# Altium schematic sheet power.SchDoc
size A4
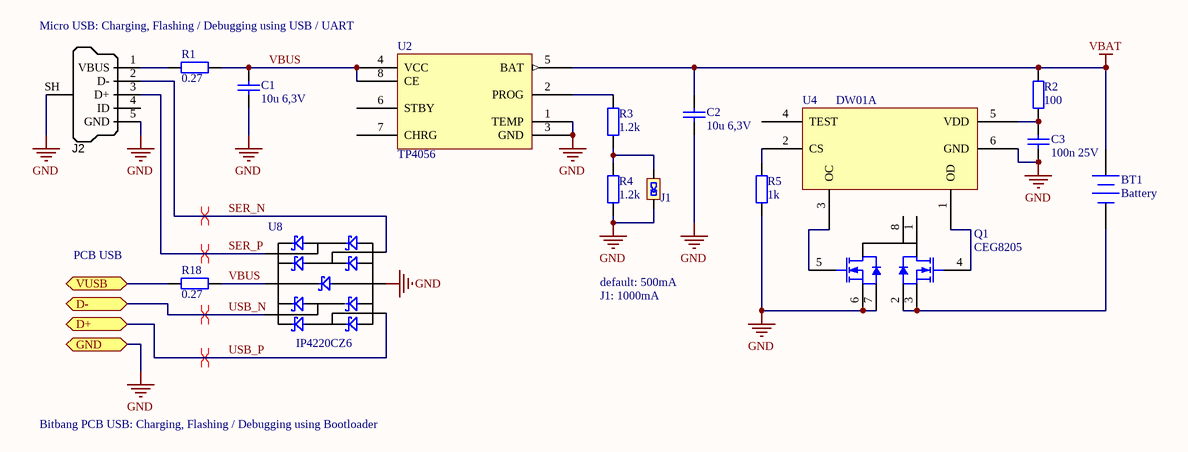
[diagram p0: power.SchDoc]

## Parts
BT1  Battery  [BAT-2]
C1  10u 6,3V  [C-0603-H]
C2  10u 6,3V  [C-0603-H]
C3  100n 25V  [C-0603-M]
J1  jumper  [JUMPER 1-1]  (value not drawn)
J2  USB Micro Type B (recommended if hand soldering)  [USB_Micro-B_FCI_SMD]  (value not drawn)
Q1  CEG8205  [TSSOP8]
R1  0.27  [R-1206-M]
R2  100  [R-0603-M]
R3  1.2k  [R-0603-M]
R4  1.2k  [R-0603-M]
R5  1k  [R-0603-M]
R18  0.27  [R-1206-M]
U2  TP4056  [SOIC127P600X20_HS-9N]
U4  DW01A  [SOT23-6]
U8  IP4220CZ6  [SOT23-6]

## Ports
D+, D-, GND, VUSB

## Nets
GND: C1.1 C2.1 C3.1 J1.2 J2.5(GND) J2.SH(Shell) Q1.6(S2) Q1.7(S2) R4.1 R5.1 U2.1(TEMP) U2.3(GND) U4.6(GND) U8.2(GND) ; port GND
VBAT: BT1.1(+) C2.2 R2.2 U2.5(BAT)
SER_N: J2.2(D-) U8.3(bla4)
SER_P: J2.3(D+) U8.4(bla2)
USB_N: U8.6(bla1) ; port D-
USB_P: U8.1(bla3) ; port D+
VBUS: C1.2 R1.2 R18.2 U2.4(VCC) U2.8(CE) U8.5(VBUS)
VUSB: R18.1 ; port VUSB
NetBT1_2: BT1.2(-) Q1.2(S1) Q1.3(S1)
NetC3_2: C3.2 R2.1 U4.5(VDD)
NetJ1_1: J1.1 R3.1 R4.2
NetJ2_1: J2.1(VBUS) R1.1
NetQ1_4: Q1.4(G1) U4.1(OD)
NetQ1_5: Q1.5(G2) U4.3(OC)
NetR3_2: R3.2 U2.2(PROG)
NetR5_2: R5.2 U4.2(CS)

Not connected (* = marked no-connect by the designer): J2 4(ID); Q1 1(S) 8(D); U2 6(STBY) 7(CHRG); U4 4(TEST)

## Layout directives
differential pair: SER_N, SER_P, USB_N, USB_P

## Notes on the sheet
- Micro USB: Charging, Flashing / Debugging using USB / UART
- PCB USB
- default: 500mA
- J1: 1000mA
- Bitbang PCB USB: Charging, Flashing / Debugging using Bootloader
- Title
- Size:
- Date:
- A4
- Number:
- Time:
- Revision:
- Sheet
- of
- File:

## Library data of the parts
BT1 = Battery: Multicell Battery; Published: 24-Mar-1999; LatestRevisionDate: 17-Jul-2002; LatestRevisionNote: Re-released for DXP Platform.; PackageReference: BAT-2; Publisher: Altium Limited; PackageDescription: Battery; 2 Leads
C1 C2 = C-0603-10u-6,3V: Capacitor 10uF 6,3V; Supplier 1: Mouser; Supplier Part Number 1: 80-C0603C106M9P
C3 = C-0603-100n-25V: Capacitor 100n 25V; Supplier 1: Mouser; Supplier Part Number 1: 80-C0603C104K3R
J1 = jumper 1-1
J2 = USB_Micro_TypeB_FCI: Connector SMD-THD USB Micro Type B middle mount; Manufacturer 1: FCI; Manufacturer Part Number 1: 10103593-0001LF; SCDType: undef; Package / Case: SMD/THD mid-mount; Supplier 1: Digi-Key; Supplier Part Number 1: 609-4049-1-ND
Q1 = MOSFET-CEG8205: Dual mini mosfet 20V 4.5A; Supplier 1: AliExpress
R1 R18 = R-1206-0R27: Resistor 0.27; Supplier 1: Mouser; Supplier Part Number 1: 71-RCWE1206R270FKEA
R2 = R-0603-100: Resistor 100; Supplier 1: Mouser; Supplier Part Number 1: 71-CRCW0603-100-E3
R3 R4 = R-0603-1k2: Resistor 1.2k
R5 = R-0603-1k: Resistor 1k; Supplier 1: Mouser; Supplier Part Number 1: 71-CRCW0603-1.0K-E3
U2 = TP4056: 1A standalone linear charging IC; Supplier 1: AliExpress
U4 = DW01A: Single Cell LiIon LiPo Protection
U8 = IP4220CZ6: USB ESD Protection